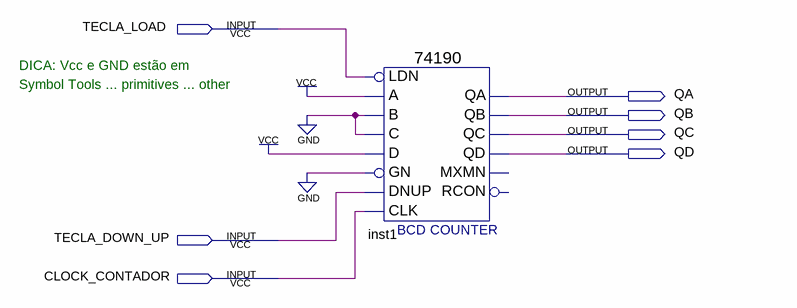
[diagram p0: schematic sheet]
// Quartus schematic contador_inicial.bdf as structural Verilog: 1 symbols, 7 pins
module contador_inicial (
  input  TECLA_LOAD,
  input  TECLA_DOWN_UP,
  input  CLOCK_CONTADOR,
  output QA,
  output QB,
  output QC,
  output QD
);

  \74190  inst1 (
    .LDN(TECLA_LOAD), .A(1'b1), .C(1'b0), .B(1'b0), .D(1'b1), .GN(1'b0), .CLK(CLOCK_CONTADOR),
    .DNUP(TECLA_DOWN_UP), .QA(QA), .QB(QB), .QD(QD), .QC(QC));  // open: MXMN, RCON

  // Notes on the sheet:
  //   DICA: Vcc e GND estão em 
  //   Symbol Tools ... primitives ... other
endmodule
